# EAGLE design moister-v1.0 (EAGLE 7.7.0)

## Sheet 1 of 4
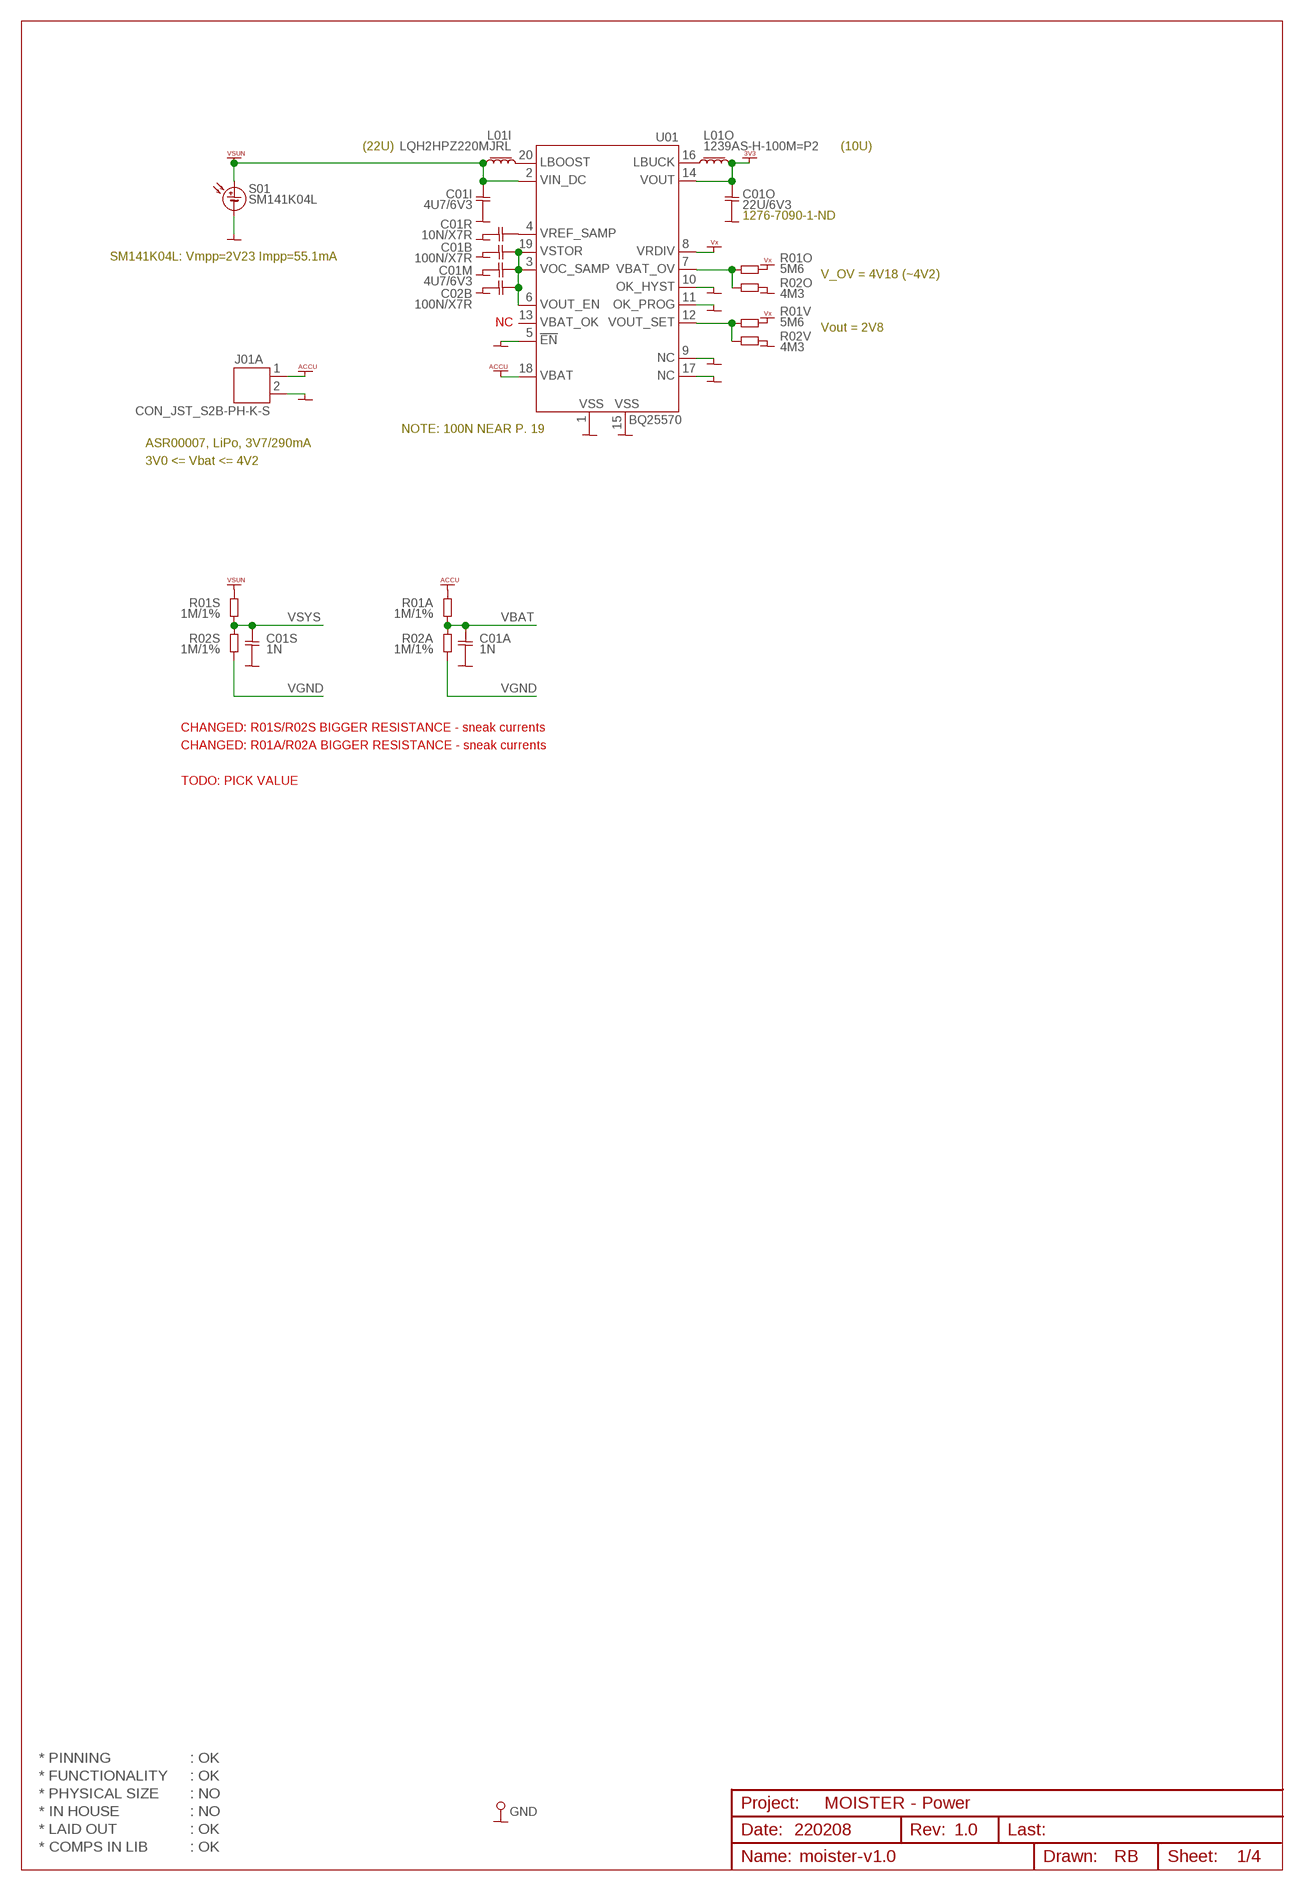
[diagram p0: schematic, sheet 1]

### Parts
C01A  1N  CAP0402  [CAP0402]
C01B  100N/X7R  CAP0402  [CAP0402]
C01I  4U7/6V3  CAP0402  [CAP0402]
C01M  4U7/6V3  CAP0402  [CAP0402]
C01O  22U/6V3  CAP0402  [CAP0402]
C01R  10N/X7R  CAP0402  [CAP0402]
C01S  1N  CAP0402  [CAP0402]
C02B  100N/X7R  CAP0402  [CAP0402]
GND  PIN_TEST  [HOLE_PTH_0.8MM]
J01A  CON_JST_S2B-PH-K-S  [CON_JST_S2B-PH-K-S]
L01I  LQH2HPZ220MJRL  L_1008  [L_1008]
L01O  1239AS-H-100M=P2  L_1008  [L_1008]
R01A  1M/1%  RES0402  [RES0402]
R01O  5M6  RES0402  [RES0402]
R01S  1M/1%  RES0402  [RES0402]
R01V  5M6  RES0402  [RES0402]
R02A  1M/1%  RES0402  [RES0402]
R02O  4M3  RES0402  [RES0402]
R02S  1M/1%  RES0402  [RES0402]
R02V  4M3  RES0402  [RES0402]
S01  SM141K04L  [SM141K04L]
U01  BQ25570  [VQFN20]

### Nets
ACCU: J01A.1 R01A.2 U01.18(18.VBAT) ; supply symbol labelled VACCU
GND: C01A.2 C01B.2 C01I.2 C01M.2 C01O.2 C01R.2 C01S.2 C02B.2 GND.1 J01A.2 R02O.2 R02V.2 S01.- U01.1(1.VSS) U01.5(5.!EN) U01.9(9.NC) U01.10(10.OK_HYST) U01.11(11.OK_PROG) U01.15(15.VSS) U01.17(17.NC) U01.TP(15.VSS) U01.V1(15.VSS) U01.V2(15.VSS) U01.V3(15.VSS) U01.V4(15.VSS) ; also sheet 2,3,4
N$11: C01R.1 U01.4(4.VREF_SAMP)
N$16: L01I.2 U01.20(20.LBOOST)
N$17: L01O.1 U01.16(16.LBUCK)
VBAT: C01A.1 R01A.1 R02A.2 ; also sheet 2
VBAT_OV: R01O.2 R02O.1 U01.7(7.VBAT_OV)
VDD_3V3: C01O.1 L01O.2 U01.14(14.VOUT) ; supply symbol labelled VCC_3V3 ; also sheet 2,3
VGND: R02A.1 R02S.1 ; also sheet 2
VOUT_SET: R01V.2 R02V.1 U01.12(12.VOUT_SET)
VSTOR: C01B.1 C01M.1 C02B.1 U01.3(3.VOC_SAMP) U01.6(6.VOUT_EN) U01.19(19.VSTOR)
VSUN: C01I.1 L01I.1 R01S.2 S01.+ U01.2(2.VIN_DC)
VSYS: C01S.1 R01S.1 R02S.2 ; also sheet 2
VX: R01O.1 R01V.1 U01.8(8.VRDIV)
Unconnected: U01.13(13.VBAT_OK)

### Notes on the sheet
- (22U) | (10U)
- 1276-7090-1-ND
- SM141K04L: Vmpp=2V23 Impp=55.1mA
- V_OV = 4V18 (~4V2)
- NC
- Vout = 2V8
- NOTE: 100N NEAR P. 19
- ASR00007, LiPo, 3V7/290mA
- 3V0 <= Vbat <= 4V2
- CHANGED: R01S/R02S BIGGER RESISTANCE - sneak currents
- CHANGED: R01A/R02A BIGGER RESISTANCE - sneak currents
- TODO: PICK VALUE
- * PINNING | : OK
- * FUNCTIONALITY | : OK
- * PHYSICAL SIZE | : NO
- MOISTER - Power
- * IN HOUSE | : NO
- * LAID OUT | : OK | 220208 | 1.0
- * COMPS IN LIB | : OK

## Sheet 2 of 4
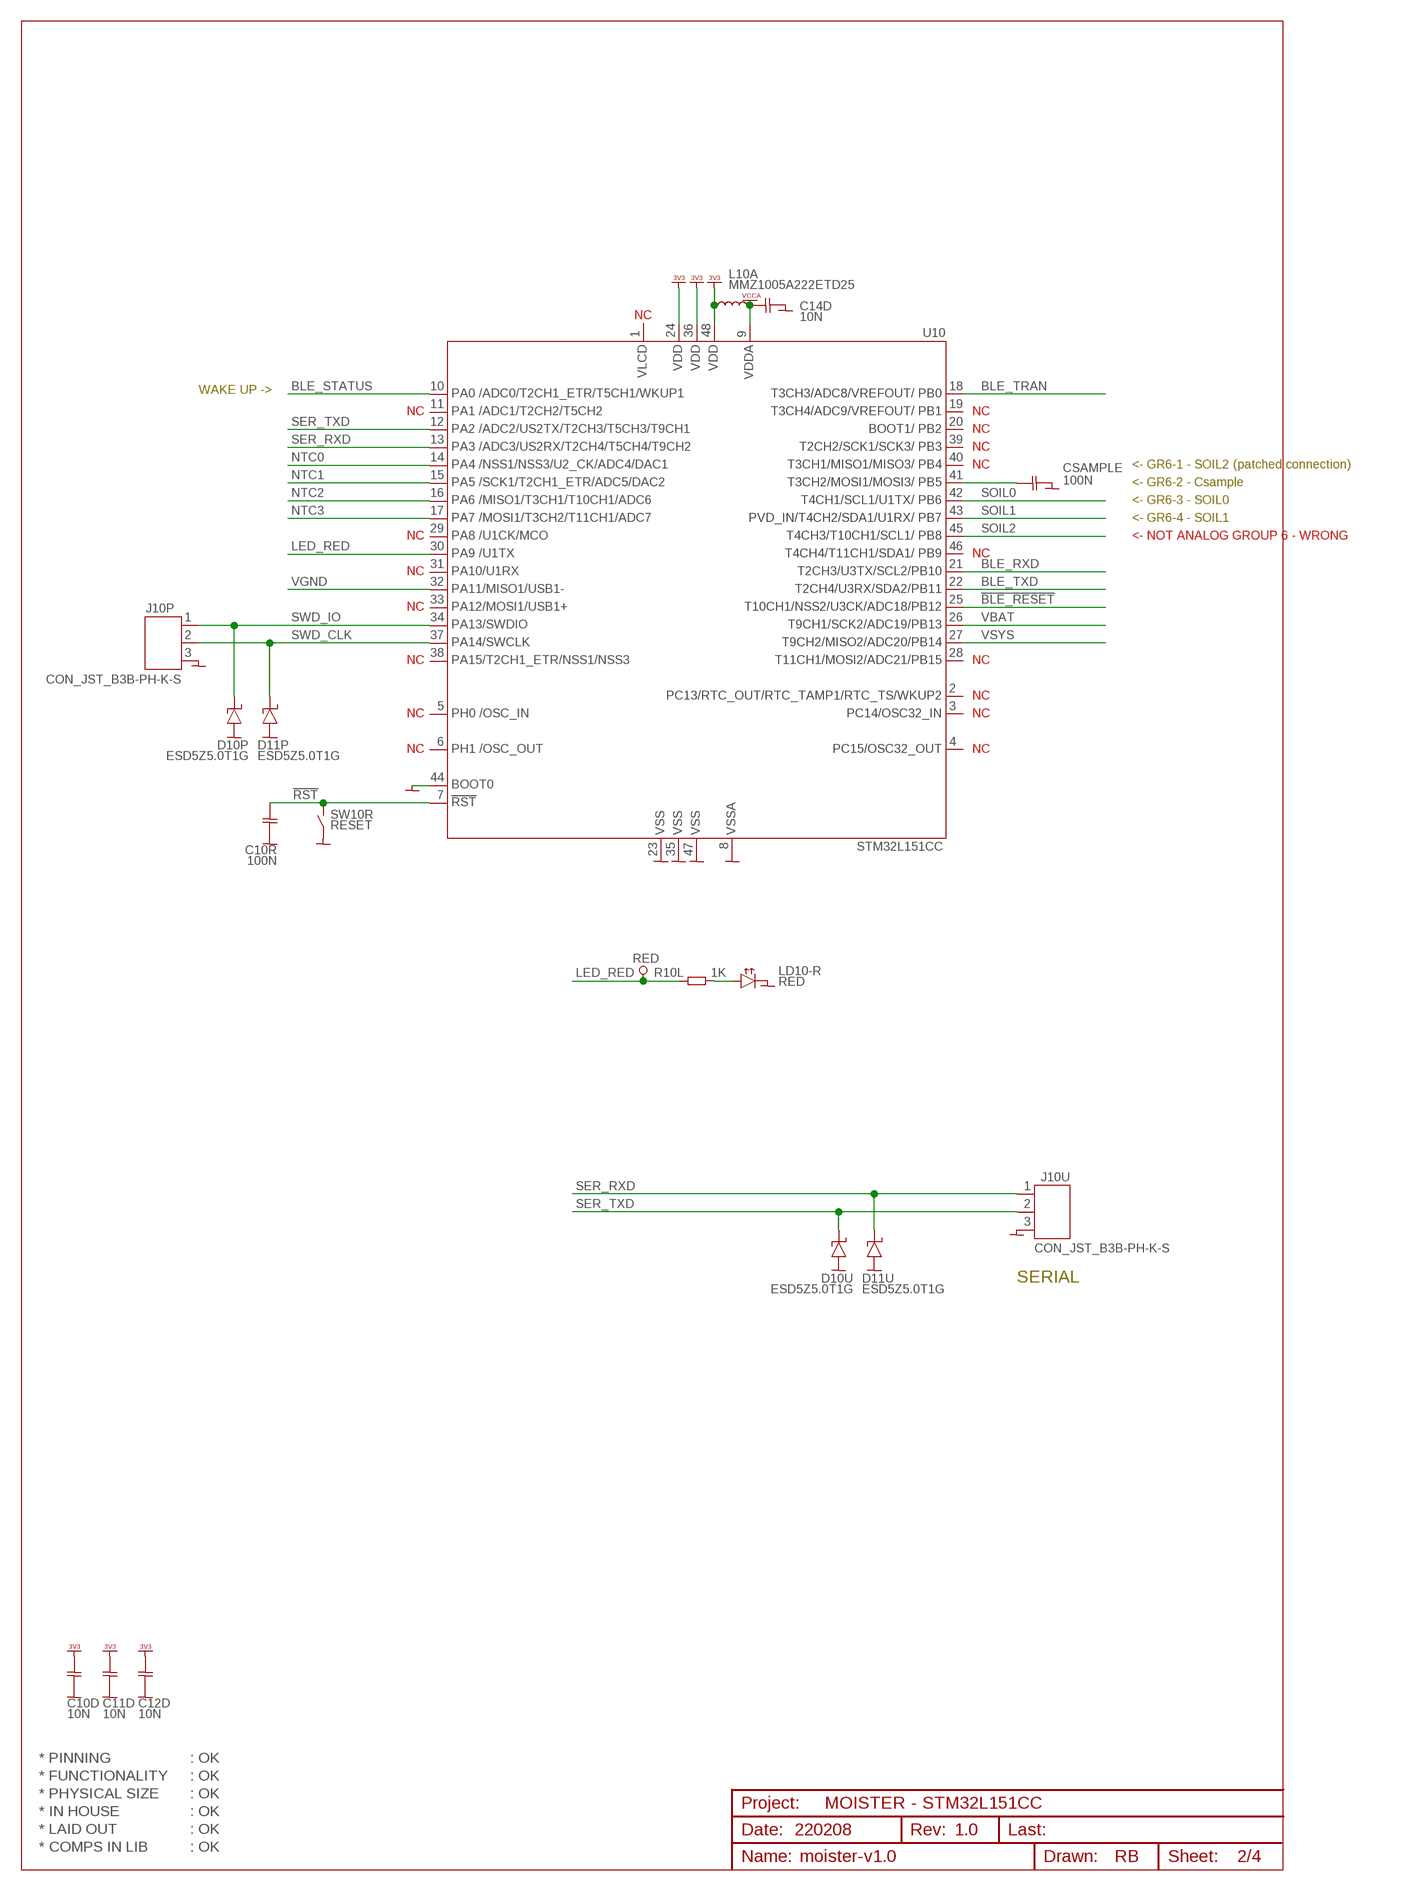
[diagram p1: schematic, sheet 2]

### Parts
C10D  10N  CAP0402  [CAP0402]
C10R  100N  CAP0402  [CAP0402]
C11D  10N  CAP0402  [CAP0402]
C12D  10N  CAP0402  [CAP0402]
C14D  10N  CAP0402  [CAP0402]
CSAMPLE  100N  CAP0603  [CAP0603]
D10P  ESD5Z5.0T1G  DIODE_TVS_SOD523  [DIODE_SOD523]
D10U  ESD5Z5.0T1G  DIODE_TVS_SOD523  [DIODE_SOD523]
D11P  ESD5Z5.0T1G  DIODE_TVS_SOD523  [DIODE_SOD523]
D11U  ESD5Z5.0T1G  DIODE_TVS_SOD523  [DIODE_SOD523]
J10P  CON_JST_B3B-PH-K-S  [CON_JST_B3B-PH-K-S]
J10U  CON_JST_B3B-PH-K-S  [CON_JST_B3B-PH-K-S]
L10A  MMZ1005A222ETD25  L_0402  [L_0402]
LD10-R  RED  LED_SMD_0402  [LED_SMD_0402]
R10L  1K  RES0402  [RES0402]
RED  PIN_TEST_0.6MM  [HOLE_PTH_0.6MM]
SW10R  RESET  SWITCH_PUSHBUTTON  [SWITCH_SMD_PBUTTON_2P]
U10  STM32L151CC  [LQFP48]

### Nets
!BLE_RESET: U10.25(25.PB12) ; also sheet 3
!RST: C10R.1 SW10R.1(1-2) U10.7(7.!RST)
BLE_RXD: U10.21(21.PB10) ; also sheet 3
BLE_STATUS: U10.10(10.PA0) ; also sheet 3
BLE_TRAN: U10.18(18.PB0) ; also sheet 3
BLE_TXD: U10.22(22.PB11) ; also sheet 3
CSAMPLE: CSAMPLE.1 U10.41(41.PB5)
GND: C10D.2 C10R.2 C11D.2 C12D.2 C14D.2 CSAMPLE.2 D10P.A D10U.A D11P.A D11U.A J10P.3 J10U.3 LD10-R.C SW10R.2(3-4) U10.8(8.GND) U10.23(23.GND) U10.35(35.GND) U10.44(44.BOOT0) U10.47(47.GND) ; also sheet 1,3,4
LED_RED: R10L.1 RED.1 U10.30(30.PA9)
N$39: LD10-R.A R10L.2
NTC0: U10.14(14.PA4) ; also sheet 4
NTC1: U10.15(15.PA5) ; also sheet 4
NTC2: U10.16(16.PA6) ; also sheet 4
NTC3: U10.17(17.PA7) ; also sheet 4
SER_RXD: D11U.C J10U.1 U10.13(13.PA3)
SER_TXD: D10U.C J10U.2 U10.12(12.PA2)
SOIL0: U10.42(42.PB6) ; also sheet 4
SOIL1: U10.43(43.PB7) ; also sheet 4
SOIL2: U10.45(45.PB8) ; also sheet 4
SWD_CLK: D11P.C J10P.2 U10.37(37.PA14)
SWD_IO: D10P.C J10P.1 U10.34(34.PA13)
VBAT: U10.26(26.PB13) ; also sheet 1
VCCA: C14D.1 L10A.2 U10.9(9.VDD) ; also sheet 4
VDD_3V3: C10D.1 C11D.1 C12D.1 L10A.1 U10.24(24.VDD) U10.36(36.VDD) U10.48(48.VDD) ; supply symbol labelled VCC_3V3 ; also sheet 1,3
VGND: U10.32(32.PA11) ; also sheet 1
VSYS: U10.27(27.PB14) ; also sheet 1
Unconnected: U10.1(1.VDD) U10.2(2.PC13) U10.3(3.PC14) U10.4(4.PC15) U10.5(5.OSC_IN) U10.6(6.OSC_OUT) U10.11(11.PA1) U10.19(19.PB1) U10.20(20.PB2) U10.28(28.PB15) U10.29(29.PA8) U10.31(31.PA10) U10.33(33.PA12) U10.38(38.PA15) U10.39(39.PB3) U10.40(40.PB4) U10.46(46.PB9)

### Notes on the sheet
- NC
- WAKE UP ->
- NC | NC
- NC
- NC
- NC | <- GR6-1 - SOIL2 (patched connection)
- <- GR6-2 - Csample
- <- GR6-3 - SOIL0
- <- GR6-4 - SOIL1
- NC | <- NOT ANALOG GROUP 6 - WRONG
- NC
- NC
- NC
- NC | NC
- NC
- NC | NC
- NC | NC
- SERIAL
- * PINNING | : OK
- * FUNCTIONALITY | : OK
- * PHYSICAL SIZE | : OK
- MOISTER - STM32L151CC
- * IN HOUSE | : OK
- * LAID OUT | : OK | 220208 | 1.0
- * COMPS IN LIB | : OK

## Sheet 3 of 4
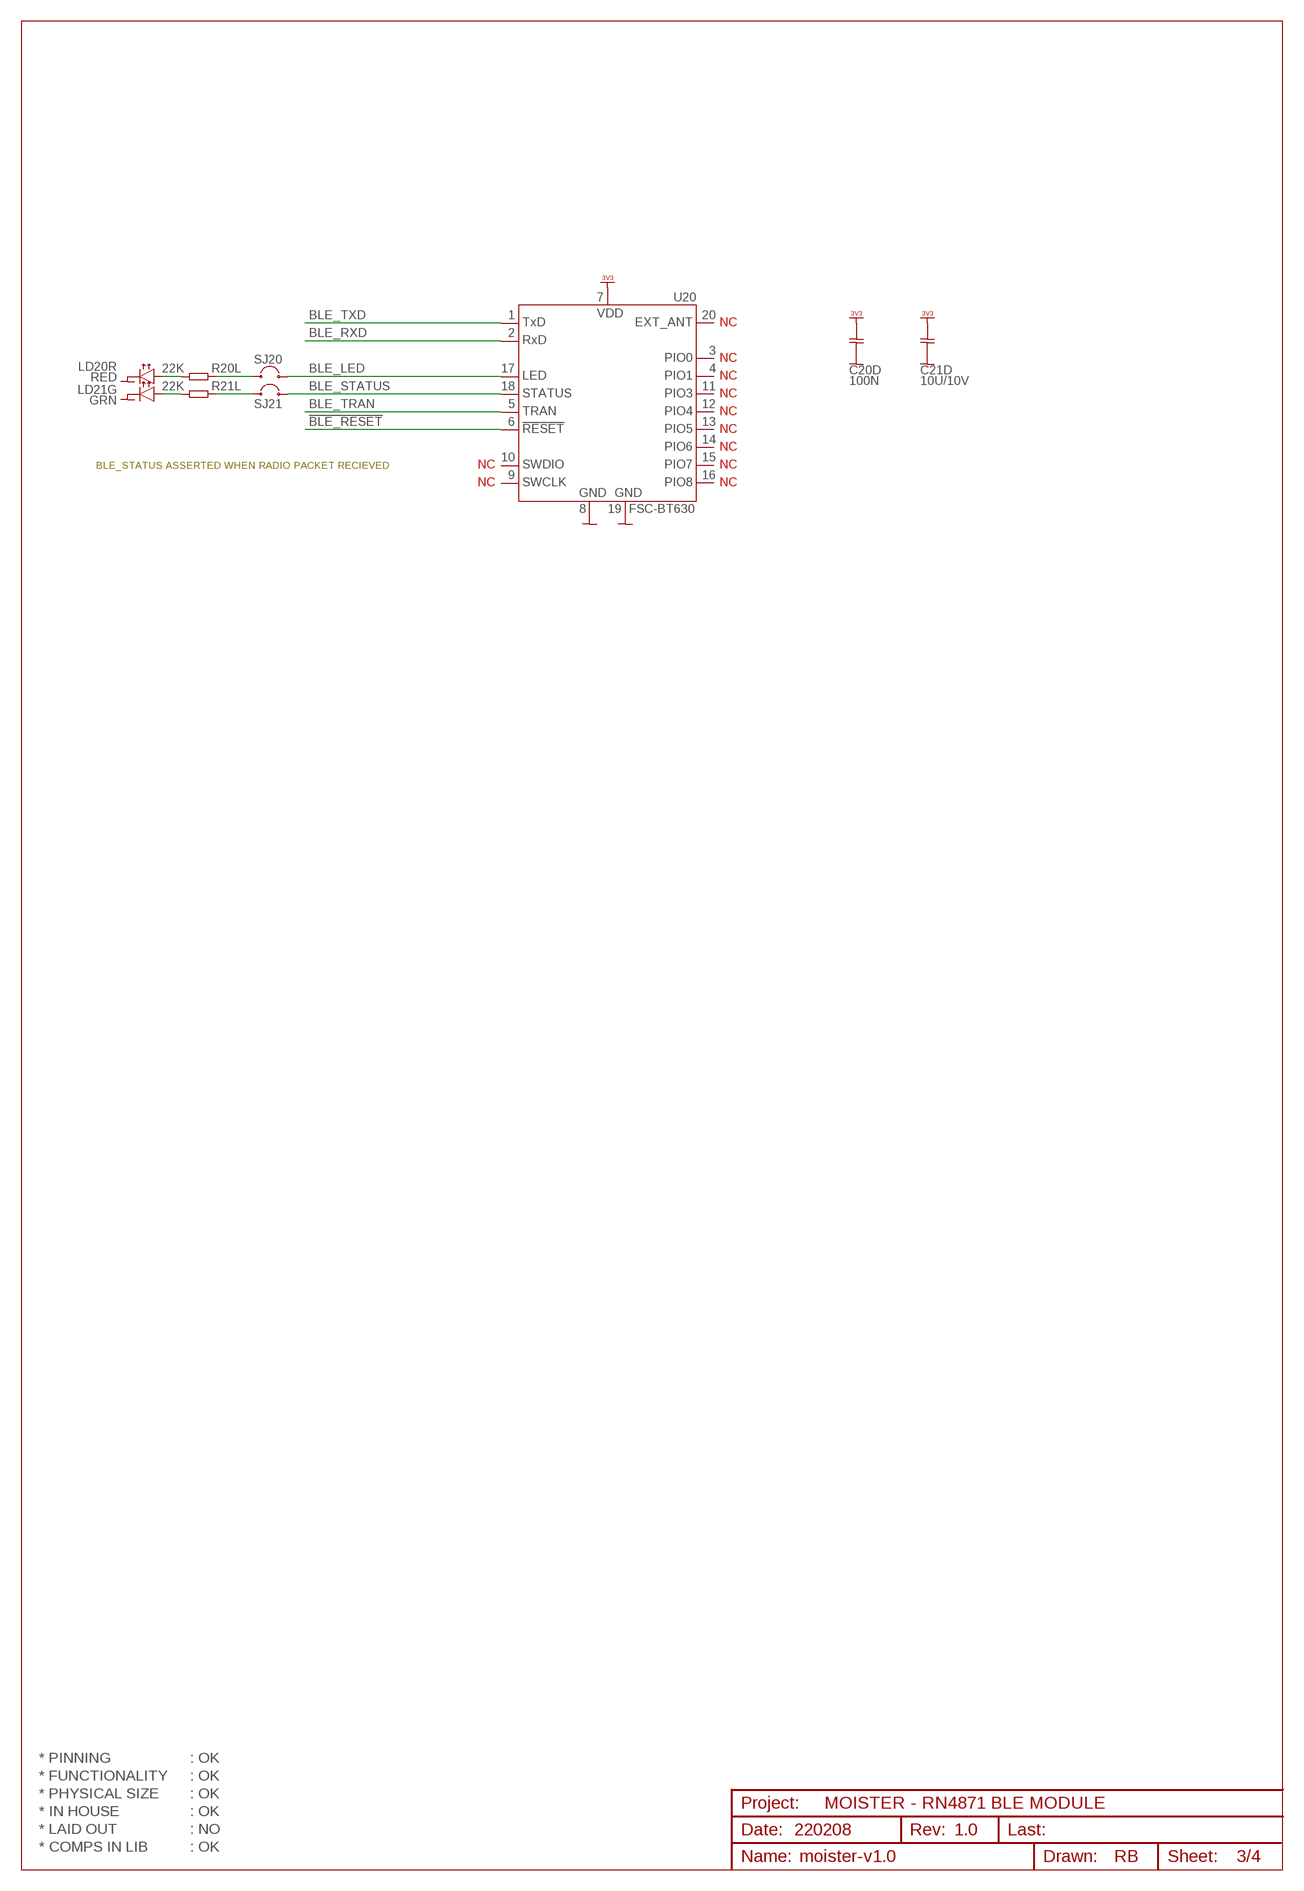
[diagram p2: schematic, sheet 3]

### Parts
C20D  100N  CAP0402  [CAP0402]
C21D  10U/10V  CAP0402  [CAP0402]
LD20R  RED  LED_SMD_0402  [LED_SMD_0402]
LD21G  GRN  LED_SMD_0402  [LED_SMD_0402]
R20L  22K  RES0402  [RES0402]
R21L  22K  RES0402  [RES0402]
SJ20  SJ2SJ2-S  [SJ2-S]
SJ21  SJ2SJ2-S  [SJ2-S]
U20  FSC-BT630  [FSC-BT630]

### Nets
!BLE_RESET: U20.6(6.!RESET) ; also sheet 2
BLE_LED: SJ20.2 U20.17(17.LED)
BLE_RXD: U20.2(2.RXD) ; also sheet 2
BLE_STATUS: SJ21.2 U20.18(18.STATUS) ; also sheet 2
BLE_TRAN: U20.5(5.TRAN) ; also sheet 2
BLE_TXD: U20.1(1.TXD) ; also sheet 2
GND: C20D.2 C21D.2 LD20R.C LD21G.C U20.8(8.GND) U20.19(19.GND) ; also sheet 1,2,4
N$1: LD20R.A R20L.2
N$5: R20L.1 SJ20.1
N$6: R21L.1 SJ21.1
N$38: LD21G.A R21L.2
VDD_3V3: C20D.1 C21D.1 U20.7(7.VDD) ; supply symbol labelled VCC_3V3 ; also sheet 1,2
Unconnected: U20.3(3.PIO0) U20.4(4.PIO1) U20.9(9.SWCLK) U20.10(10.SWDIO) U20.11(11.PIO3) U20.12(12.PIO4) U20.13(13.PIO5) U20.14(14.PIO6) U20.15(15.PIO7) U20.16(16.PIO8) U20.20(20.EXT_ANT)

### Notes on the sheet
- NC
- NC
- NC
- NC
- NC
- NC
- NC
- BLE_STATUS ASSERTED WHEN RADIO PACKET RECIEVED | NC | NC
- NC | NC
- * PINNING | : OK
- * FUNCTIONALITY | : OK
- * PHYSICAL SIZE | : OK
- MOISTER - RN4871 BLE MODULE
- * IN HOUSE | : OK
- * LAID OUT | : NO | 220208 | 1.0
- * COMPS IN LIB | : OK

## Sheet 4 of 4
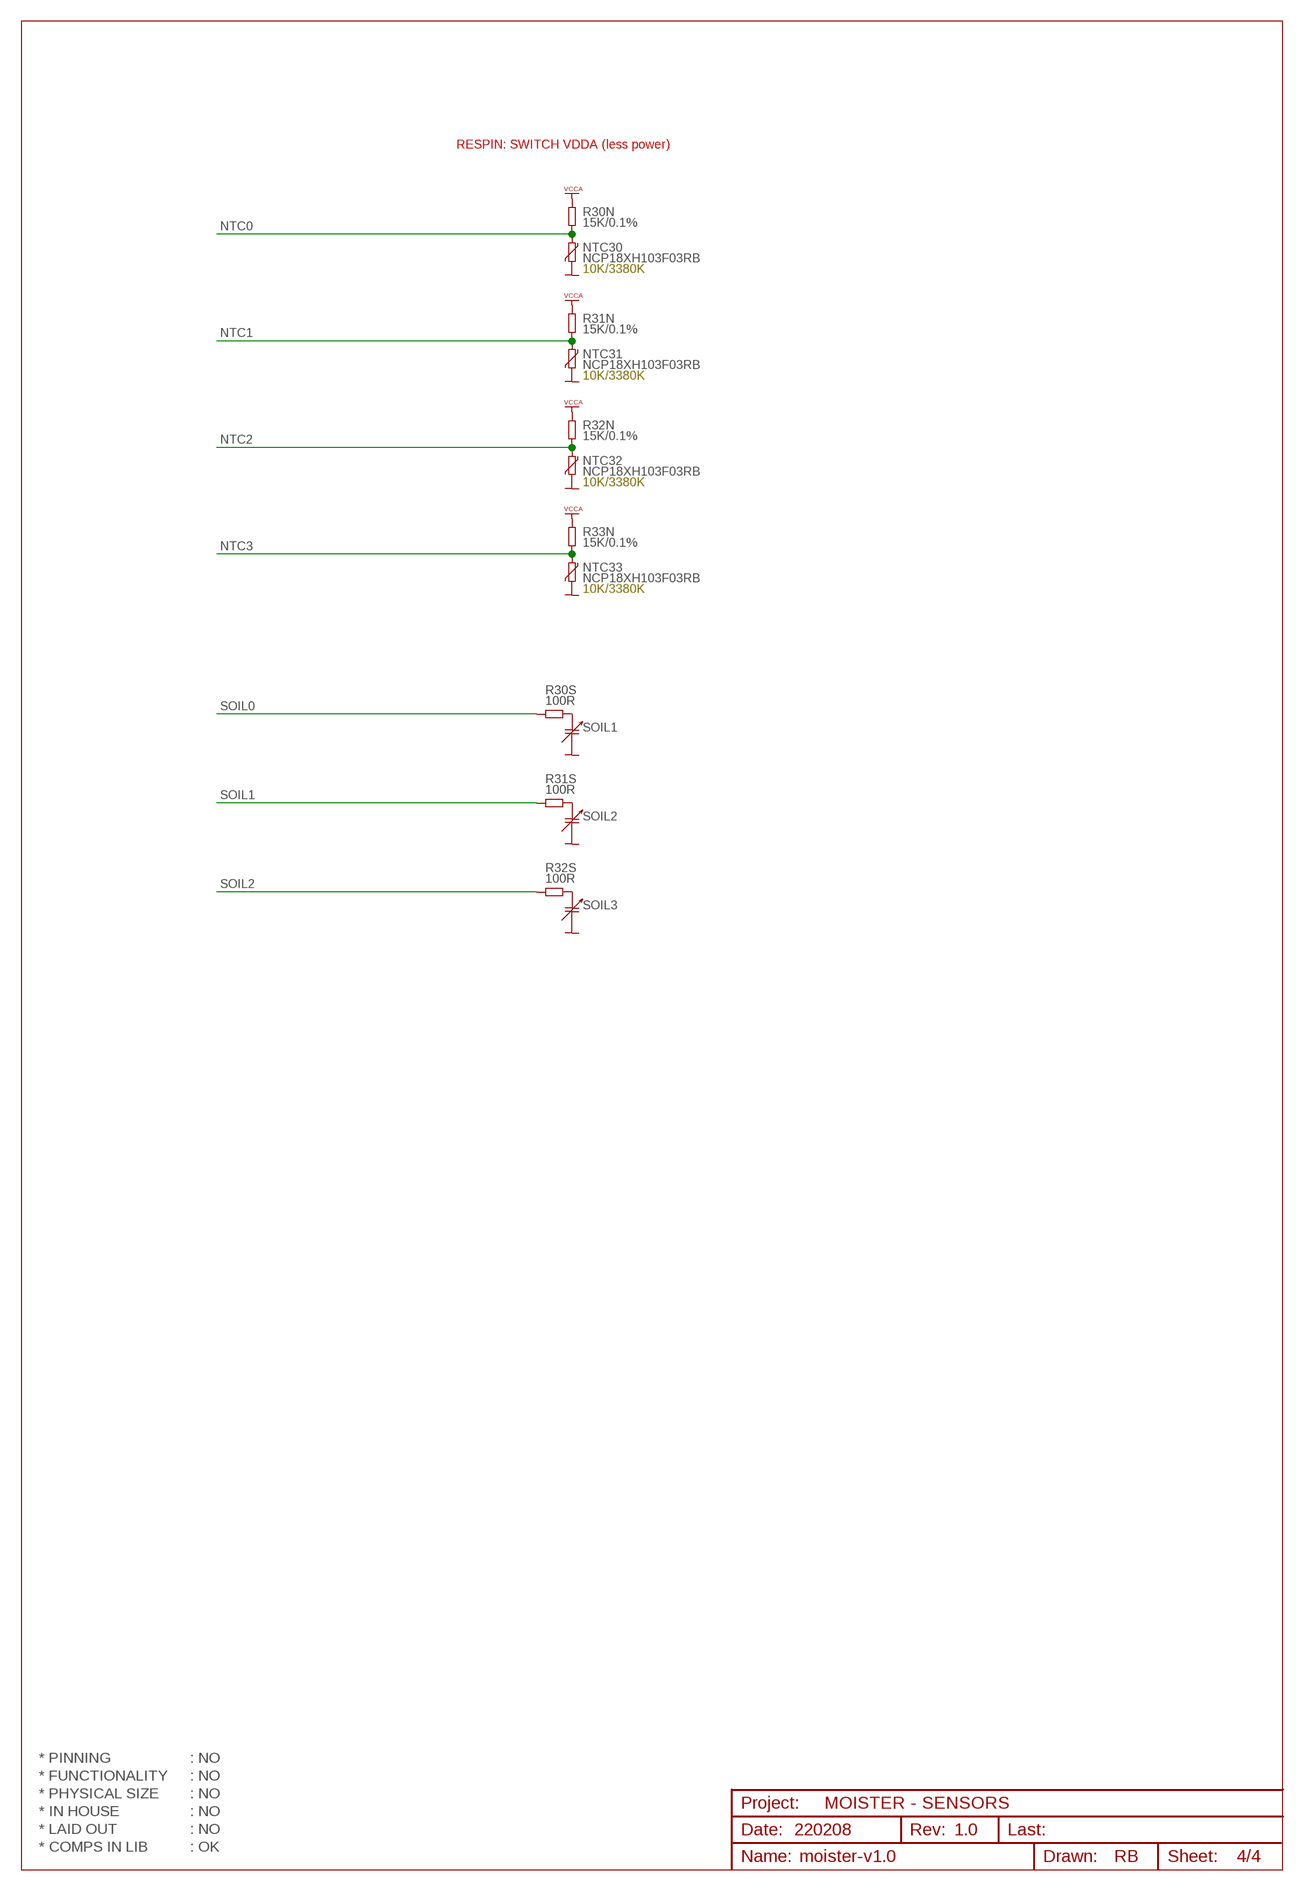
[diagram p3: schematic, sheet 4]

### Parts
NTC30  NCP18XH103F03RB  NTC0603  [RES0603]
NTC31  NCP18XH103F03RB  NTC0603  [RES0603]
NTC32  NCP18XH103F03RB  NTC0603  [RES0603]
NTC33  NCP18XH103F03RB  NTC0603  [RES0603]
R30N  15K/0.1%  RES0402  [RES0402]
R30S  100R  RES0402  [RES0402]
R31N  15K/0.1%  RES0402  [RES0402]
R31S  100R  RES0402  [RES0402]
R32N  15K/0.1%  RES0402  [RES0402]
R32S  100R  RES0402  [RES0402]
R33N  15K/0.1%  RES0402  [RES0402]
SOIL1  CAP_SOIL_SINGLE_2LAYER  [CAP_SOIL_SINGLE_2LAYER]
SOIL2  CAP_SOIL_SINGLE_2LAYER  [CAP_SOIL_SINGLE_2LAYER]
SOIL3  CAP_SOIL_SINGLE_2LAYER  [CAP_SOIL_SINGLE_2LAYER]

### Nets
GND: NTC30.1 NTC31.1 NTC32.1 NTC33.1 SOIL1.2 SOIL2.2 SOIL3.2 ; also sheet 1,2,3
N$2: R30S.2 SOIL1.1
N$3: R31S.2 SOIL2.1
N$4: R32S.2 SOIL3.1
NTC0: NTC30.2 R30N.2 ; also sheet 2
NTC1: NTC31.2 R31N.2 ; also sheet 2
NTC2: NTC32.2 R32N.2 ; also sheet 2
NTC3: NTC33.2 R33N.2 ; also sheet 2
SOIL0: R30S.1 ; also sheet 2
SOIL1: R31S.1 ; also sheet 2
SOIL2: R32S.1 ; also sheet 2
VCCA: R30N.1 R31N.1 R32N.1 R33N.1 ; also sheet 2

### Notes on the sheet
- RESPIN: SWITCH VDDA (less power)
- 10K/3380K
- 10K/3380K
- 10K/3380K
- 10K/3380K
- * PINNING | : NO
- * FUNCTIONALITY | : NO
- * PHYSICAL SIZE | : NO
- MOISTER - SENSORS
- * IN HOUSE | : NO
- * LAID OUT | : NO | 220208 | 1.0
- * COMPS IN LIB | : OK

## Library data of the parts
C01A C01B C01I C01M C01O C01R C01S C02B C10D C10R C11D C12D C14D C20D C21D = 00-own_parts:CAP0402: Capacitor, ceramic, 0402
CSAMPLE = 00-own_parts:CAP0603: Capacitor, ceramic, 0603
D10P D10U D11P D11U = 00-own_parts:DIODE_TVS_SOD523: Diode, transient surpressor, SOD523
GND = 00-own_parts:PIN_TEST: Pin, test pad, hole 0.8mm, pad 1.6mm
J01A = 00-own_parts:CON_JST_S2B-PH-K-S: Connector, JST, 2.0mm pitch, 2p, side entry
J10P J10U = 00-own_parts:CON_JST_B3B-PH-K-S: Connector, JST, 2.0mm pitch, 3p, top entry
L01I L01O = 00-own_parts:L_1008: Inductor, 1008 (2520 metric), chip ferrite bead/wirewound
L10A = 00-own_parts:L_0402: Inductor, 0402
LD10-R LD20R LD21G = 00-own_parts:LED_SMD_0402: LED, SMD, 0402 (PICOLED)
NTC30-NTC33 = 00-own_parts:NTC
R01A R01O R01S R01V R02A R02O R02S R02V R10L R20L R21L R30N R30S R31N R31S R32N R32S R33N = 00-own_parts:RES
RED = 00-own_parts:PIN_TEST_0.6MM: Pin, test pad, hole 0.6mm, pad 1.0mm
S01 = 00-own_parts:SM141K04L: Solar cell, monocrystalline, high efficiency, 29x23mm, Voc = 2V76, Isc = 58.6mA, Vmpp = 2V23, Impp = 55.1mA, Vmmp @ 81% Voc
SJ20 SJ21 = 00-own_parts:SJ2: Solder jumper, SMD, 2 way
SOIL1-SOIL3 = 00-own_parts:CAP_SOIL_SINGLE_2LAYER: Capacitor, soil moisture senso, bi-layer
SW10R = 00-own_parts:SWITCH_PUSHBUTTON: Switch, push button, SPNO, MCTAEF, F# 160-5485
U01 = 00-own_parts:BQ25570: DC/DC, nano power boost battery charger with MPPT and buck converter DC/DC, VQFN20
U10 = 00-own_parts:STM32L151CC: MCU, ultra-low power, ARM Cortex M3, 32-bit, 32 MHz, 256 kB Flash, 32 kB SRAM, 8 kB EEPROM, USB, ADC, DAC, LQFP48
U20 = 00-own_parts:FSC-BT630: Wireless module, Bluetooth Low Energy, integrated antenna

## Board
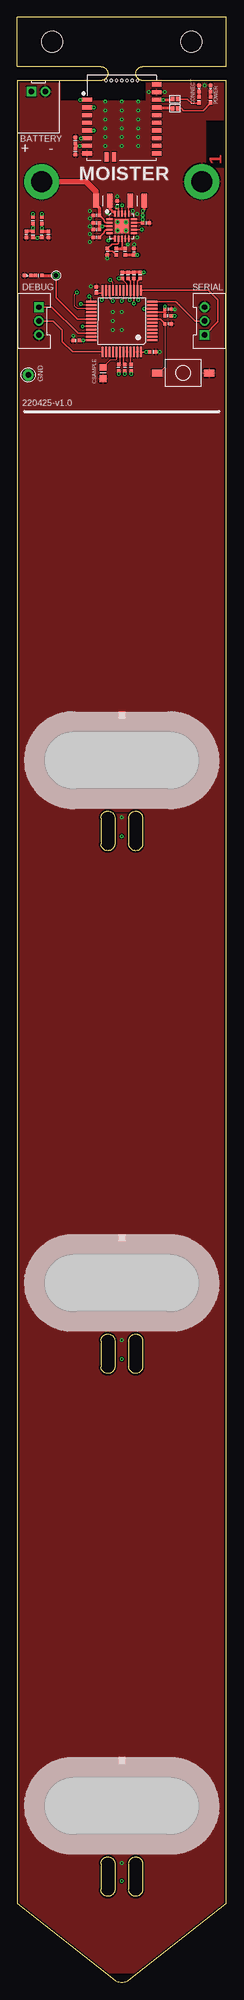
[diagram p4: board, top side]
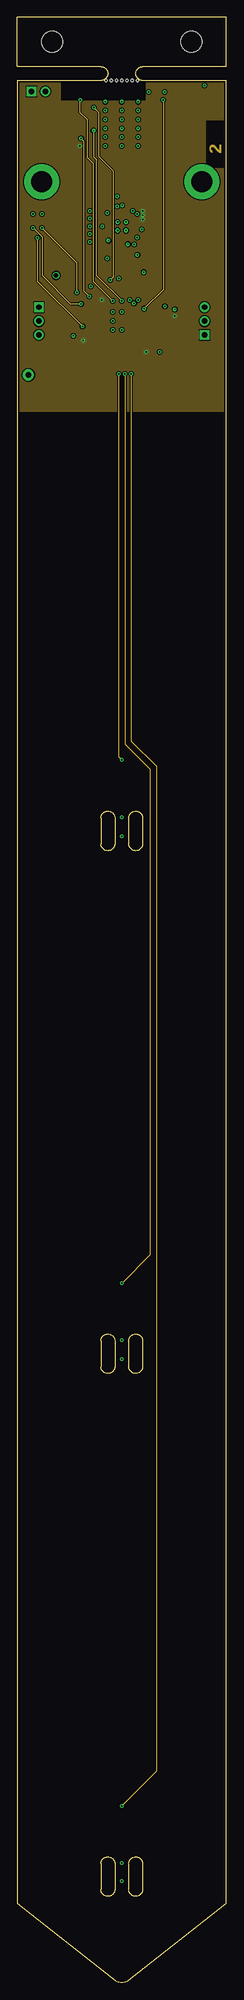
[diagram p5: board, inner layer Route2]
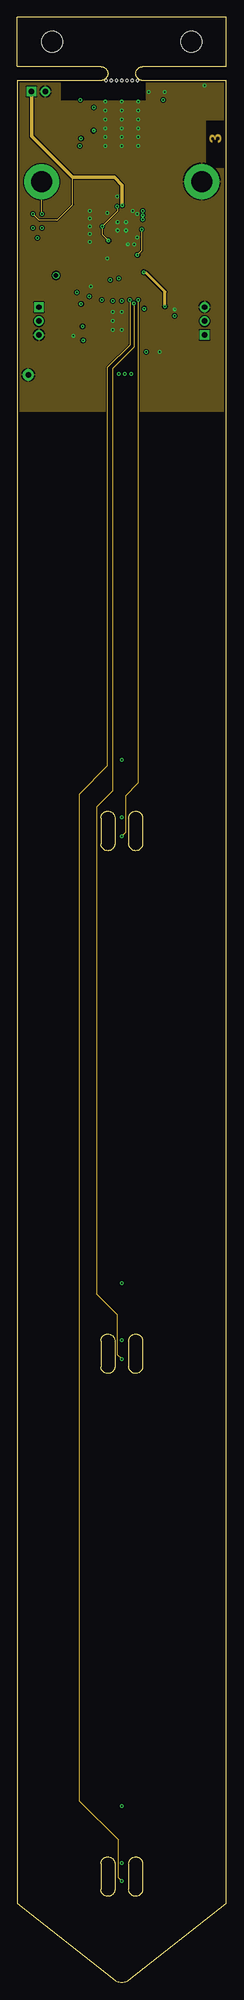
[diagram p6: board, inner layer Route15]
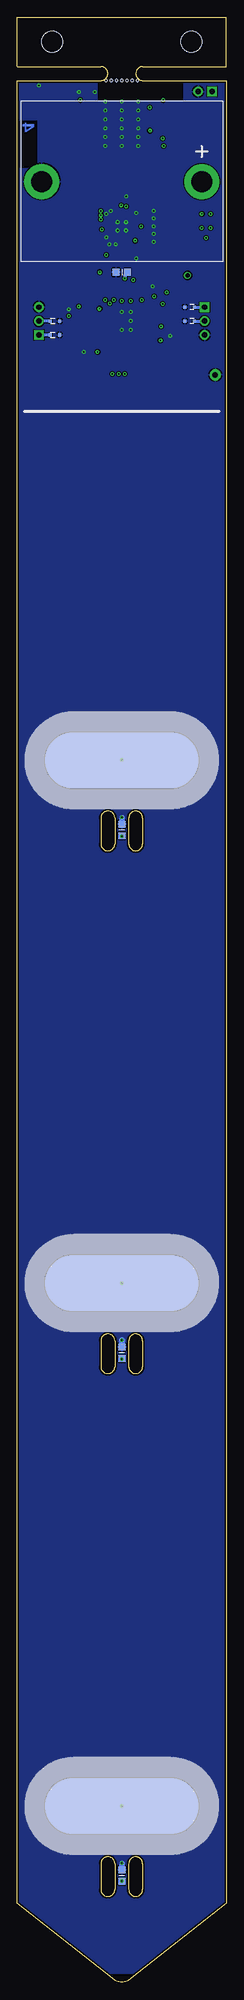
[diagram p7: board, bottom side, seen from below]

Size 30 x 281.83 mm. Coordinates in mm from the lower left corner, seen from the top.
Outline: 18,272.78 30,272.78 30,11.28 16.36,0.53 arc-85 13.64,0.53 0,11.28 0,272.78 12,272.78
Outline: 0,274.83 0,281.83 30,281.83 30,274.83
Outline: 30,274.78 18,274.78
Outline: 12,274.78 0,274.78
Outline: 14,166.98 14,163.28 arc-180 12,163.28 12,166.98 arc-180 14,166.98
Outline: 16,166.98 16,163.28 arc180 18,163.28 18,166.98 arc180 16,166.98
Outline: 14,91.98 14,88.28 arc-180 12,88.28 12,91.98 arc-180 14,91.98
Outline: 16,91.98 16,88.28 arc180 18,88.28 18,91.98 arc180 16,91.98
Outline: 14,16.98 14,13.28 arc-180 12,13.28 12,16.98 arc-180 14,16.98
Outline: 16,16.98 16,13.28 arc180 18,13.28 18,16.98 arc180 16,16.98
Copper layers (1*2*15*16): Top 0.018mm / dielectric 0.36mm / Route2 0.035mm / dielectric 0.71mm / Route15 0.035mm / dielectric 0.36mm / Bottom 0.018mm
Design rules "default *": minimum track width 0.15mm, minimum drill 0.15mm, track to track 0.15mm, track to pad 0.15mm, pad to pad 0.15mm, via to via 0.15mm, smd to smd 0mil, copper to edge 0.25mm, drill to drill 0.3mm, minimum pad ring 0.2mm, minimum via ring 0.125mm, stop-mask expansion 0.1mm, vias tented up to drill 0.25mm, thermal gap 0.2mm
tRestrict: 1 lines

### Footprints (pad centres in the part's own frame; a part is rotated, then mirrored left to right if it is on the bottom)
CAP0402 = smd 0.5 x 0.5: 1 -0.45,0; 2 0.45,0
CAP0603 = smd 0.95 x 1: 1 -0.821,0.002; 2 0.822,0
DIODE_SOD523 = smd 0.45 x 0.45: A 0.675,0; C -0.675,0
HOLE_PTH_0.8MM = drill 0.8 pad 1.6: 1 0,0
CON_JST_S2B-PH-K-S = drill 0.75 pad 1.4 square: 1 -1,0 | drill 0.75 pad 1.4: 2 1,0
CON_JST_B3B-PH-K-S = drill 0.75 pad 1.4 square: 1 -2,0 | drill 0.75 pad 1.4: 2 0,0; 3 2,0
L_1008 = smd 0.8 x 2: 1 -1,0; 2 1,0
L_0402 = smd 0.5 x 0.5: 1 -0.45,0; 2 0.45,0
LED_SMD_0402 = smd 0.5 x 0.5: A -0.45,0; C 0.45,0.001
RES0603 = smd 0.95 x 1: 1 -0.821,0.002; 2 0.822,0
RES0402 = smd 0.5 x 0.5: 1 -0.45,0; 2 0.45,0
HOLE_PTH_0.6MM = drill 0.6 pad 1: 1 0,0
SM141K04L = drill 3 pad 5: + -11.5,0; - 11.5,0
SJ2-S = smd 0.5 x 0.6: 1 -0.35,0; 2 0.35,0
CAP_SOIL_SINGLE_2LAYER = smd 1 x 1: 1 9.5,0; 2 0,6.5
SWITCH_SMD_PBUTTON_2P = smd 1.5 x 1: 1 -3.75,0; 2 3.75,0
VQFN20 = smd 0.28 x 0.85: 1 -1,-1.775; 2 -0.5,-1.775; 3 0,-1.775; 4 0.5,-1.775; 5 1,-1.775; 11 1,1.775; 12 0.5,1.775; 13 0,1.775; 14 -0.5,1.775; 15 -1,1.775 | smd 0.85 x 0.28: 6 1.775,-1; 7 1.775,-0.5; 8 1.775,0; 9 1.775,0.5; 10 1.775,1; 16 -1.775,1; 17 -1.775,0.5; 18 -1.775,0; 19 -1.775,-0.5; 20 -1.775,-1 | smd 2 x 2: TP 0,0 | drill 0.2 pad 0.5: V1 -0.6,0.6; V2 0.6,0.6; V3 -0.6,-0.6; V4 0.6,-0.6
LQFP48 = smd 0.28 x 1.5: 1 -2.75,-4.4; 2 -2.25,-4.4; 3 -1.75,-4.4; 4 -1.25,-4.4; 5 -0.75,-4.4; 6 -0.25,-4.4; 7 0.25,-4.4; 8 0.75,-4.4; 9 1.25,-4.4; 10 1.75,-4.4; 11 2.25,-4.4; 12 2.75,-4.4; 25 2.75,4.4; 26 2.25,4.4; 27 1.75,4.4; 28 1.25,4.4; 29 0.75,4.4; 30 0.25,4.4; 31 -0.25,4.4; 32 -0.75,4.4; 33 -1.25,4.4; 34 -1.75,4.4; 35 -2.25,4.4; 36 -2.75,4.4 | smd 1.5 x 0.28: 13 4.4,-2.75; 14 4.4,-2.25; 15 4.4,-1.75; 16 4.4,-1.25; 17 4.4,-0.75; 18 4.4,-0.25; 19 4.4,0.25; 20 4.4,0.75; 21 4.4,1.25; 22 4.4,1.75; 23 4.4,2.25; 24 4.4,2.75; 37 -4.4,2.75; 38 -4.4,2.25; 39 -4.4,1.75; 40 -4.4,1.25; 41 -4.4,0.75; 42 -4.4,0.25; 43 -4.4,-0.25; 44 -4.4,-0.75; 45 -4.4,-1.25; 46 -4.4,-1.75; 47 -4.4,-2.25; 48 -4.4,-2.75
FSC-BT630 = smd 1.4 x 0.6: 1 -5,8.7; 2 -5,7.6; 3 -5,6.5; 4 -5,5.4; 5 -5,4.3; 6 -5,3.2; 7 -5,2.1; 8 -5,1; 11 5,1; 12 5,2.1; 13 5,3.2; 14 5,4.3; 15 5,5.4; 16 5,6.5; 17 5,7.6; 18 5,8.7; 19 5,9.8; 20 5,10.9 | smd 0.6 x 1.4: 9 -2.2,0.5; 10 -1.1,0.5
EC_MOUSEBITES = hole 0.35: 0,0; 0,-0.75; 0,-1.5; 0,0.75; 0,1.5; 0,2.25; 0,-2.25
EC_TOOL-REGISTRATION = hole 3: 0,0

### Placement (x,y rotation side)
C01A  1.28,250.69 270 top
C01B  11.35,251.39 180 top
C01I  11.35,253.46 180 top
C01M  11.35,252.35 180 top
C01O  18.49,252.35 0 top
C01R  11.35,250.28 180 top
C01S  4.46,250.69 270 top
C02B  14.37,255.04 90 top
C10D  11.35,242.74 90 top
C10R  21.65,237.88 0 top
C11D  8.46,235.48 180 top
C12D  19.45,233.85 0 top
C14D  21.65,239.98 0 top
C20D  8.33,262.6 270 top
C21D  8.33,264.18 90 top
CSAMPLE  12.3,230.83 270 top
D10P  5.25,240.28 180 bottom
D10U  24.6,238.28 0 bottom
D11P  5.25,238.28 180 bottom
D11U  24.6,236.28 0 bottom
GND  1.57,230.55 90 top
J01A  3.02,271.2 0 top
J10P  3.1,238.28 270 top
J10U  26.9,238.28 90 top
L01I  12.3,255.52 0 top
L01O  17.22,255.52 0 top
L10A  21.65,239.03 180 top
LD10-R  1.47,244.82 180 top
LD20R  27.75,271.63 90 top
LD21G  26.1,271.63 90 top
NTC30  15,165.28 270 bottom
NTC31  15,90.28 270 bottom
NTC32  15,15.28 270 bottom
NTC33  15,245.28 0 bottom
R01A  2.24,252.76 90 top
R01O  14.21,248.22 270 top
R01S  3.51,252.75 90 top
R01V  15.48,248.22 270 top
R02A  2.24,250.69 90 top
R02O  12.94,248.22 270 top
R02S  3.51,250.69 90 top
R02V  16.75,248.22 90 top
R10L  3.05,244.82 180 top
R20L  27.75,269.98 90 top
R21L  26.1,269.98 90 top
R30N  17.65,244.83 270 top
R30S  14.55,231.58 270 top
R31N  16.75,244.83 270 top
R31S  15.45,231.58 270 top
R32N  15.9,244.83 270 top
R32S  16.35,231.58 270 top
R33N  15.05,244.83 270 top
RED  5.54,244.82 0 top
S01  15,258.28 180 bottom
SJ20  22.65,268.78 180 top
SJ21  22.65,270.13 180 top
SOIL1  15,175.28 0 top
SOIL2  15,100.28 0 top
SOIL3  15,25.28 0 top
SW10R  23.81,230.82 0 top
U01  15,251.87 270 top
U10  15,238.28 90 top
U20  15,261.31 0 top
U$45  [EC_MOUSEBITES]  15,272.78 90 top
U$46  [EC_TOOL-REGISTRATION]  5,278.33 90 top
U$47  [EC_TOOL-REGISTRATION]  25,278.33 90 top

### Tracks (layer width: path | path; a pad name or v marks a point on that pad's centre or on a via)
!BLE_RESET  (via drill 0.2 pad 0.5)
  Top 0.15: U10.25 10.6,241.53 v10.35,241.78 | 9.97,264.48 U20.6
  Top 0.5: v9.15,264.48 9.97,264.48
  Route2 0.15: v10.35,241.78 9.6,242.53 9.6,264.03 v9.15,264.48
!RST
  Top 0.15: SW10R.1 20.07,230.83 20.4,230.83 21.2,231.63 C10R.1
  Top 0.2: U10.7 20.55,238.53 C10R.1
ACCU  (via drill 0.2 pad 0.5)
  Top 0.203: U01.18 15,254.83 v15.06,254.89
  Top 0.4: R01A.2 2.25,253.22 v2.25,253.63
  Route15 0.15: 7.95,258.88 7.95,254.98 5.7,252.73 3.15,252.73 v2.25,253.63
  Route15 0.5: v15.06,254.89 15.06,257.77 13.95,258.88 7.95,258.88 2.02,264.81 J01A.1
BLE_LED
  Top 0.4: U20.17 22.17,268.91 SJ20.2
BLE_RXD  (via drill 0.2 pad 0.5)
  Top 0.15: U10.21 13.75,243.78 v13.35,244.18
  Top 0.5: U20.2 10.02,268.93 v11,268.93
  Route2 0.15: v13.35,244.18 13.8,244.63 13.8,259.78 11.7,261.88 11.7,268.18 11,268.88 v11,268.93
BLE_STATUS  (via drill 0.2 pad 0.5)
  Top 0.2: U10.10 18.21,240.03 v18.2,240.05
  Top 0.4: U20.18 v20.94,270.01 v20.95,270 22.17,270 SJ21.2
  Route2 0.15: v20.95,270 20.95,242.8 v18.2,240.05
BLE_TRAN  (via drill 0.2 pad 0.5)
  Top 0.15: U10.18 15.25,241.43 v15,241.18
  Top 0.5: v10.95,265.58 10.03,265.58 U20.5
  Route2 0.15: v15,241.18 11.4,244.78 11.4,261.43 10.95,261.88 v10.95,265.58
BLE_TXD  (via drill 0.2 pad 0.5)
  Top 0.254: U10.22 13.25,241.63 v13.73,241.15
  Top 0.5: v9.04,270 U20.1
  Route2 0.15: v13.73,241.15 10.95,243.93 10.95,260.83 10.05,261.73 10.05,267.13 9.04,268.14 v9.04,270
CSAMPLE
  Top 0.15: U10.41 14.25,232.78 14.1,232.63 13.28,232.63 CSAMPLE.1
GND  (via drill 0.2 pad 0.5)
  Bottom 0.8: v15,17.06 15,16.03 | v15,167.08 15,166.03
  Bottom 0.9: NTC31.1 v15,92.08
  other vias: 17.38,263.39 15,263.39 12.62,263.39 17.38,264.66 15,264.66 15,269.74 12.62,264.66 17.38,265.93 15,265.93 12.62,269.74 12.62,265.93 17.38,267.2 15,267.2 12.62,267.2 17.38,268.47 15,268.47 17.38,269.74 12.62,268.47 13.73,237.02 13.73,239.56 15,237.02 13.73,238.29 15,239.56 10.4,251.87 10.4,252.98 10.4,250.76 10.4,249.65 10.4,254.09 14.37,256.16 16.59,254.09 15.89,249.3 12.91,247.24 16.77,249.24 12.94,253.77 17.22,250.28 17.22,253.62 10.55,243.21 18.86,271.12 21.14,271.12 8.03,236.17 22.63,239.97 20.43,233.87 26.89,272.07
  pour Top (rank 6): 30.1,11.28 17.1,1.28 12.95,1.28 0.05,11.28 0,272.78 30,272.78
  pour Route15 (rank 2): 30,225.28 0,225.28 0.05,272.78 30,272.78
  pour Bottom (rank 6): 30.1,11.28 17.1,1.28 12.95,1.28 0.05,11.28 0,272.78 30,272.78
LED_RED
  Top 0.2: U10.30 8.65,238.53 5.54,241.64 RED.1
  Top 0.457: R10L.1 RED.1
N$1
  Top 0.4: R20L.2 LD20R.A
N$2  (via drill 0.2 pad 0.5)
  Top 0.15: v15,175.33 24.45,175.33 SOIL1.1
  Top 0.4: R30S.2 v14.55,230.68
  Route2 0.15: v14.55,230.68 14.55,175.78 v15,175.33
N$3  (via drill 0.2 pad 0.5)
  Top 0.2: SOIL2.1 15.05,100.28 v15,100.23
  Top 0.4: R31S.2 v15.45,230.68
  Route2 0.15: v15.45,230.68 15.45,177.58 19.05,173.98 19.05,104.28 v15,100.23
N$4  (via drill 0.2 pad 0.5)
  Top 0.15: v15,25.28 SOIL3.1
  Top 0.4: R32S.2 v16.35,230.68
  Route2 0.15: v16.35,230.68 16.35,178.03 19.95,174.43 19.95,30.23 v15,25.28
N$5
  Top 0.2: SJ20.1 23.55,268.78 23.85,268.48 26.7,268.48 R20L.1
N$6
  Top 0.2: R21L.1 25.05,269.53 24.45,270.13 SJ21.1
N$11
  Top 0.2: U01.4 12.74,251.37 12.45,251.08 12.45,250.93 C01R.1
N$16
  Top 0.305: U01.20 14,253.66 13.73,253.93
  Top 0.457: L01I.2 13.3,254.36 13.73,253.93
N$17
  Top 0.2: U01.16 16,255.3
  Top 0.254: 16,255.3 L01O.1
N$21
  cutout Top: 27.15,260.28 27.15,267.03 29.7,267.03 29.7,260.28
  cutout Bottom: 27.15,260.28 27.15,267.03 29.7,267.03 29.7,260.28
  cutout Route15: 27.15,260.28 27.15,267.03 29.7,267.03 29.7,260.28
  cutout Route2: 27.15,260.28 27.15,267.03 29.7,267.03 29.7,260.28
  cutout Top: 18.4,269.98 6.25,269.98 6.25,272.53 18.4,272.53
  cutout Bottom: 18.4,269.98 6.25,269.98 6.25,272.53 18.4,272.53
  cutout Route15: 18.4,269.98 6.25,269.98 6.25,272.53 18.4,272.53
  cutout Route2: 18.4,269.98 6.25,269.98 6.25,272.53 18.4,272.53
N$38
  Top 0.4: LD21G.A R21L.2
N$39
  Top 0.457: R10L.2 LD10-R.A
NTC0  (via drill 0.2 pad 0.5)
  Top 0.2: R30N.2 17.25,243.98 U10.14 17.25,241.38 v17.35,241.28
  Route15 0.15: v17.35,241.28 17.35,171.98 15.6,170.23 15.6,164.98 v15,164.38
  Bottom 0.15: NTC30.2 v15,164.38
NTC1  (via drill 0.2 pad 0.5)
  Top 0.2: R31N.2 U10.15 v16.75,240.83
  Route15 0.15: v16.75,240.83 16.75,234.53 13.65,231.43 13.65,170.83 11.4,168.58 11.4,98.73 14.4,95.73 14.4,89.98 v15,89.38
  Bottom 0.15: v15,89.38 NTC31.2
NTC2  (via drill 0.2 pad 0.5)
  Top 0.2: R32N.2 16.25,244.03 U10.16 16.25,241.38 v16.15,241.28
  Route15 0.15: v16.15,241.28 16.15,234.83 12.9,231.58 12.9,174.43 8.85,170.38 8.85,26.03 14.5,20.38 14.5,14.98 v15,14.48
  Bottom 0.15: NTC32.2 v15,14.48
NTC3  (via drill 0.2 pad 0.5)
  Top 0.15: U10.17 15.75,243.58 15.2,244.13 15.2,244.23 R33N.2
  Top 0.4: v14.55,244.38 R33N.2
  Bottom 0.5: v14.55,244.38 14.55,244.91 NTC33.2
SER_RXD
  Top 0.2: U10.13 27.45,242.68 28.8,241.33 28.8,238.18 J10U.1
  Bottom 0.4: D11U.C J10U.1 26.7,236.28
SER_TXD
  Top 0.2: U10.12 22.8,241.03 25.55,238.28 J10U.2
  Bottom 0.4: D10U.C J10U.2 26.7,238.28
SOIL0
  Top 0.2: U10.42 14.75,232.23 R30S.1
SOIL1
  Top 0.2: U10.43 15.25,232.23 R31S.1
SOIL2
  Top 0.2: U10.45 16.25,232.13 R32S.1
SWD_CLK
  Top 0.2: U10.37 7.9,233.88 6.45,235.33 6.45,236.98 5.15,238.28 J10P.2
  Bottom 0.4: D11P.C J10P.2 3.3,238.28
SWD_IO
  Top 0.2: U10.34 8.7,236.53 4.95,240.28 J10P.1
  Bottom 0.4: D10P.C J10P.1 3.3,240.28
VBAT  (via drill 0.2 pad 0.5)
  Top 0.15: U10.26 9.35,240.53 v9.15,240.73
  Top 0.457: R01A.1 v2.24,251.65 R02A.2 C01A.1
  Route2 0.15: v2.24,251.65 2.28,251.65 3.6,250.33 3.6,244.78 7.65,240.73 v9.15,240.73
VBAT_OV
  Top 0.152: R01O.2 14.21,247.74
  Top 0.2: U01.7 14.5,249.46 14.37,249.33 | 13.57,249.33 12.94,248.69 | R01O.2 13.7,248.28 13.33,248.28 R02O.1
  Top 0.203: 14.37,249.33 13.57,249.33 | 12.94,248.69 R02O.1
VCCA  (via drill 0.2 pad 0.5)
  Top 0.15: R30N.1 v18.15,245.28
  Top 0.2: U10.9 21.2,239.53
  Top 0.4: R30N.1 R31N.1 R32N.1 R33N.1 | L10A.2 21.2,239.53 C14D.1 v21.2,240.38
  Route15 0.4: v18.15,245.28 18.4,245.28 21.2,242.48 v21.2,240.38
VDD_3V3  (via drill 0.2 pad 0.5)
  Top 0.15: 9.47,235.53 v9.44,235.5
  Top 0.2: U01.14 18.02,252.37 | C10D.1 12.16,242.29 12.25,242.38 | U10.36 9.47,235.53 | v18.48,233.85 17.78,233.85 U10.48
  Top 0.254: U10.24 12.25,242.38 12.25,241.41 v12.14,241.31 | 18.02,252.37 C01O.1
  Top 0.4: C21D.1 8.33,263.38 | 8.33,263.38 C20D.1 | v8.99,263.41 8.96,263.38 8.33,263.38 | v22.6,239.02 v22.6,239.03 L10A.1 | C11D.1 9.43,235.48 v9.44,235.5
  Top 0.457: C12D.1 v18.48,233.85 | L01O.2 18.18,255.47 18.18,254.25 v18.02,254.09 v18.02,253.46 v18.02,252.82 17.99,252.8 17.99,252.4 C01O.1
  Top 0.5: U20.7 v8.99,263.41
  pour Route2 (rank 2): 30,225.28 0,225.28 0,272.78 30,272.78
VGND  (via drill 0.2 pad 0.5)
  Top 0.2: U10.32 9.38,237.53 v9.37,237.51
  Top 0.4: R02A.1 2.85,250.24 v2.87,250.22 2.9,250.24 R02S.1
  Route2 0.15: v9.37,237.51 v9.36,237.51 3.22,243.65 3,243.88 2.87,244.01 v2.87,250.22
VOUT_SET  (via drill 0.2 pad 0.5)
  Top 0.2: U01.12 17.83,251.37
  Top 0.254: 17.83,251.37 v17.86,251.39
  Top 0.457: R01V.2 R02V.1
  Top 0.5: R02V.1 v17.25,247.77 v17.25,247.76
  Route15 0.15: v17.86,251.39 17.86,248.36 v17.25,247.76
VSTOR  (via drill 0.2 pad 0.5)
  Top 0.2: U01.19 14.5,254.46
  Top 0.254: U01.3 v12.2,251.87 | 14.5,254.46 C02B.1 v14.37,254.73
  Top 0.305: U01.6 13.38,250.09 v13.1,249.81
  Top 0.457: C01B.1 11.8,252.03 | 11.8,252.03 C01M.1 | v12.2,251.87 11.96,251.87 11.8,252.03
  Route15 0.15: v14.37,254.73 14.37,254.03 v12.2,251.87 12.2,250.7 v13.1,249.81
VSUN  (via drill 0.2 pad 0.5)
  Top 0.2: U01.2 12.67,252.37 12.46,252.58 12.46,252.82 11.82,253.46
  Top 0.254: C01I.1 11.82,253.46
  Top 0.4: S01.+ | R01S.2 v3.5,253.63
  Top 0.5: C01I.1 11.8,254.43 11.3,254.93 L01I.1
  Top 0.8: L01I.1 11.3,256.83 9.85,258.28 S01.+
  Route15 0.15: v3.5,253.63 S01.+
VSYS  (via drill 0.2 pad 0.5)
  Top 0.15: U10.27 8.65,240.03 8.25,240.43 8.25,242.08 v8.55,242.38
  Top 0.457: R01S.1 v3.51,251.65 R02S.2 C01S.1
  Route2 0.15: v8.55,242.38 8.55,246.6 v3.51,251.65
VX
  Top 0.305: U01.8 15,248.67
  Top 0.457: R01O.1 15,248.67 R01V.1

### Text on the board
Top: 1
Route2: 2
Route15: 3
Bottom: 4
tPlace: CONNECT | POWER | BATTERY | + | - | MOISTER | DEBUG | SERIAL | 220425-v1.0